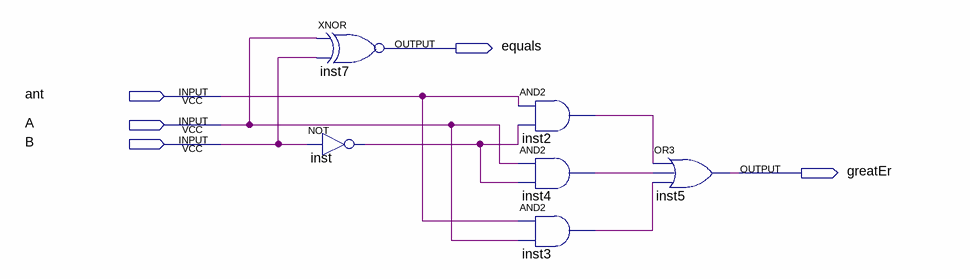
[diagram p0: schematic sheet]
// Quartus schematic MaiorQueBit.bdf as structural Verilog: 6 symbols, 5 pins
module MaiorQueBit (
  input  ant,
  input  A,
  input  B,
  output equals,
  output greatEr
);

  wire inst2_out, inst3_out, inst4_out, inst_out;

  xnor inst7 (equals, A, B);
  not inst (inst_out, B);
  and inst2 (inst2_out, ant, inst_out);
  and inst4 (inst4_out, A, inst_out);
  and inst3 (inst3_out, ant, A);
  or inst5 (greatEr, inst2_out, inst4_out, inst3_out);
endmodule
